# Altium schematic sheet OSSI-1 Beacon_0.SchDoc: TITLE:
size 410 x 286 mm; Date: Date:; >LAST_DATE_TIME: 01/11/2015 13:17:32; Sheet:: Sheet:; >SHEET: 1; REV:: REV:; Document Number:: Document Number:; >DRAWING_NAME: OSSI-1 Beacon.sch
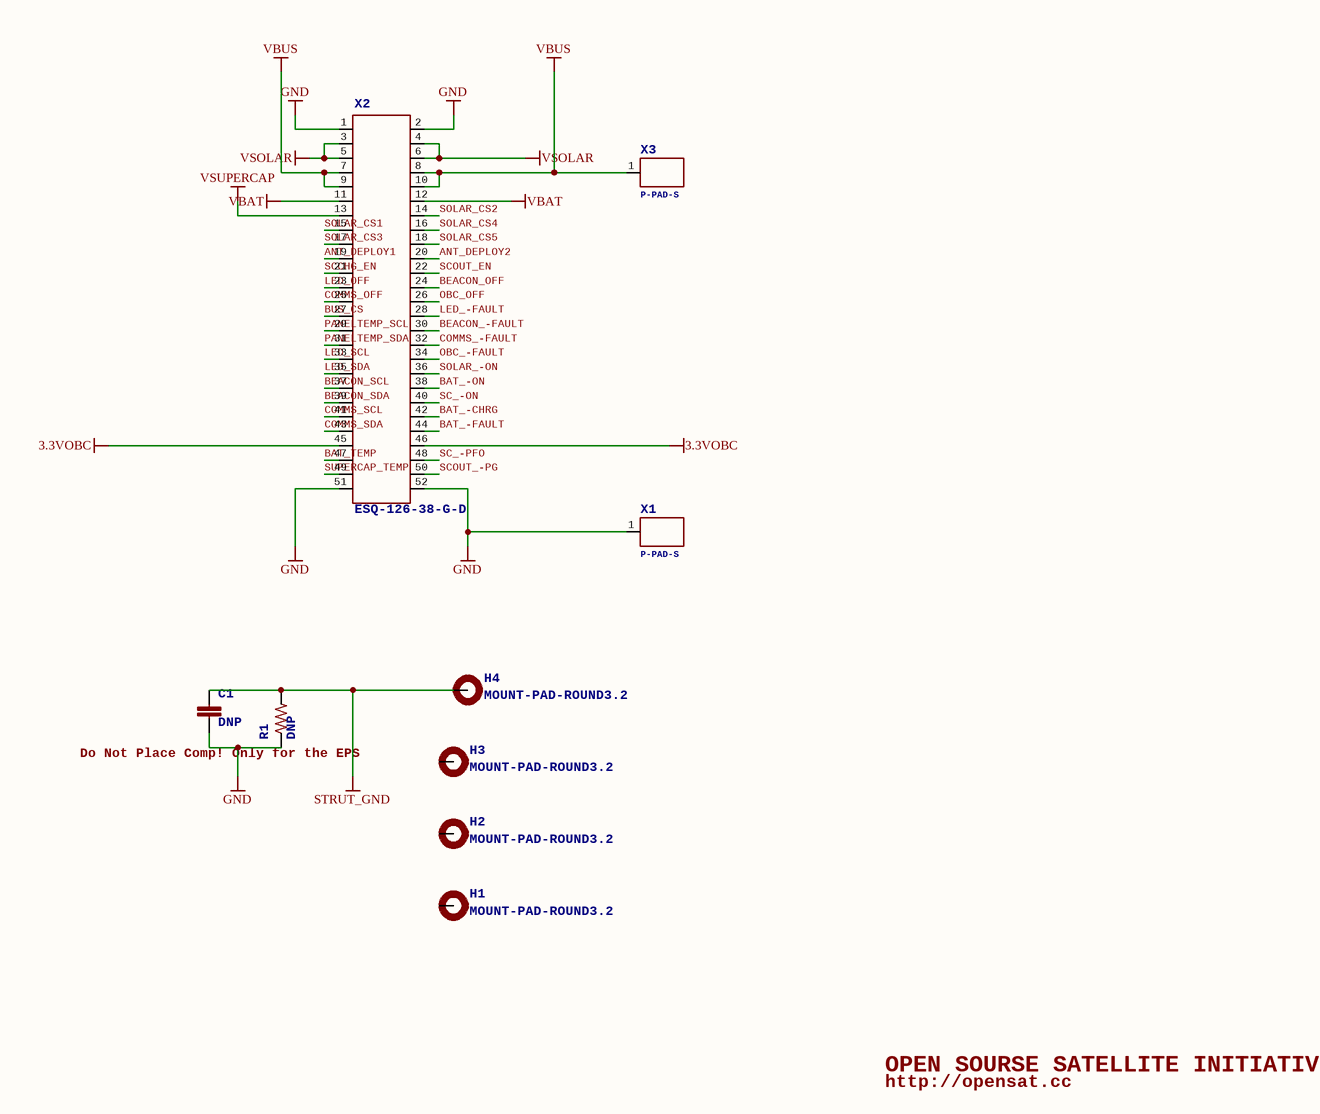
[diagram p0: OSSI-1 Beacon_0.SchDoc]

## Parts
C1  >NAME: C1  [C0805(2012)]  (hidden comment: DNP)
H1  >NAME: H1  [3.2-PAD-ROUND]  (hidden comment: MOUNT-PAD-ROUND3.2)
H2  >NAME: H2  [3.2-PAD-ROUND]  (hidden comment: MOUNT-PAD-ROUND3.2)
H3  >NAME: H3  [3.2-PAD-ROUND]  (hidden comment: MOUNT-PAD-ROUND3.2)
H4  >NAME: H4  [3.2-PAD-ROUND]  (hidden comment: MOUNT-PAD-ROUND3.2)
R1  >NAME: R1  [WSL1206]  (hidden comment: DNP)
X1  >NAME: X1  [P-PAD-S]  (hidden comment: P-PAD-S)
X2  >NAME: X2  [ESQ-126-XX-X-D]  (hidden comment: ESQ-126-38-G-D)
X3  >NAME: X3  [P-PAD-S]  (hidden comment: P-PAD-S)

## Nets
3.3VOBC: X2.45 X2.46
GND: C1.2 R1.P$1 X1.1(P$1) X2.1 X2.2 X2.51 X2.52
STRUT_GND: C1.1 H4.B3,2(MOUNT) R1.P$2
VBAT: X2.11 X2.12
VBUS: X2.7 X2.8 X2.9 X2.10 X3.1(P$1)
VSOLAR: X2.3 X2.4 X2.5 X2.6
VSUPERCAP: X2.13
ANT_DEPLOY1: X2.19
ANT_DEPLOY2: X2.20
BAT_-CHRG: X2.42
BAT_-FAULT: X2.44
BAT_-ON: X2.38
BAT_TEMP: X2.47
BEACON_-FAULT: X2.30
BEACON_OFF: X2.24
BEACON_SCL: X2.37
BEACON_SDA: X2.39
BUS_CS: X2.27
COMMS_-FAULT: X2.32
COMMS_OFF: X2.25
COMMS_SCL: X2.41
COMMS_SDA: X2.43
LED_-FAULT: X2.28
LED_OFF: X2.23
LED_SCL: X2.33
LED_SDA: X2.35
OBC_-FAULT: X2.34
OBC_OFF: X2.26
PANELTEMP_SCL: X2.29
PANELTEMP_SDA: X2.31
SC_-ON: X2.40
SC_-PFO: X2.48
SCCHG_EN: X2.21
SCOUT_-PG: X2.50
SCOUT_EN: X2.22
SOLAR_-ON: X2.36
SOLAR_CS1: X2.15
SOLAR_CS2: X2.14
SOLAR_CS3: X2.17
SOLAR_CS4: X2.16
SOLAR_CS5: X2.18
SUPERCAP_TEMP: X2.49

Not connected (* = marked no-connect by the designer): H1 B3,2(MOUNT); H2 B3,2(MOUNT); H3 B3,2(MOUNT)

## Notes on the sheet
- (near R1) Do Not Place Comp! Only for the EPS
- OPEN SOURSE SATELLITE INITIATIVE
- http://opensat.cc

## Library data of the parts
C1 = C0805(2012): >VALUE: DNP
R1 = RWSL1206: >VALUE: DNP
X2 = ESQ-126-38-G-D: <b>Samtec ESQ-126-XX-G-D Elevated Sockets Seires</b> / <ul> / <li> ESQ-126-37-G-D</li> / <li> ESQ-126-38-G-D</li> / <li> ESQ-126-39-G-D</li> / </ul>; >VALUE: ESQ-126-38-G-D
H1-H4 = MOUNT-PAD-ROUND3.2: >VALUE: MOUNT-PAD-ROUND3.2
X1 X3 = P-PAD-S: >VALUE: P-PAD-S